# Altium schematic sheet MCU_3.6.SchDoc: MCU_3.6
size A3; DrawnBy: Máni Magnússon; Revision: A
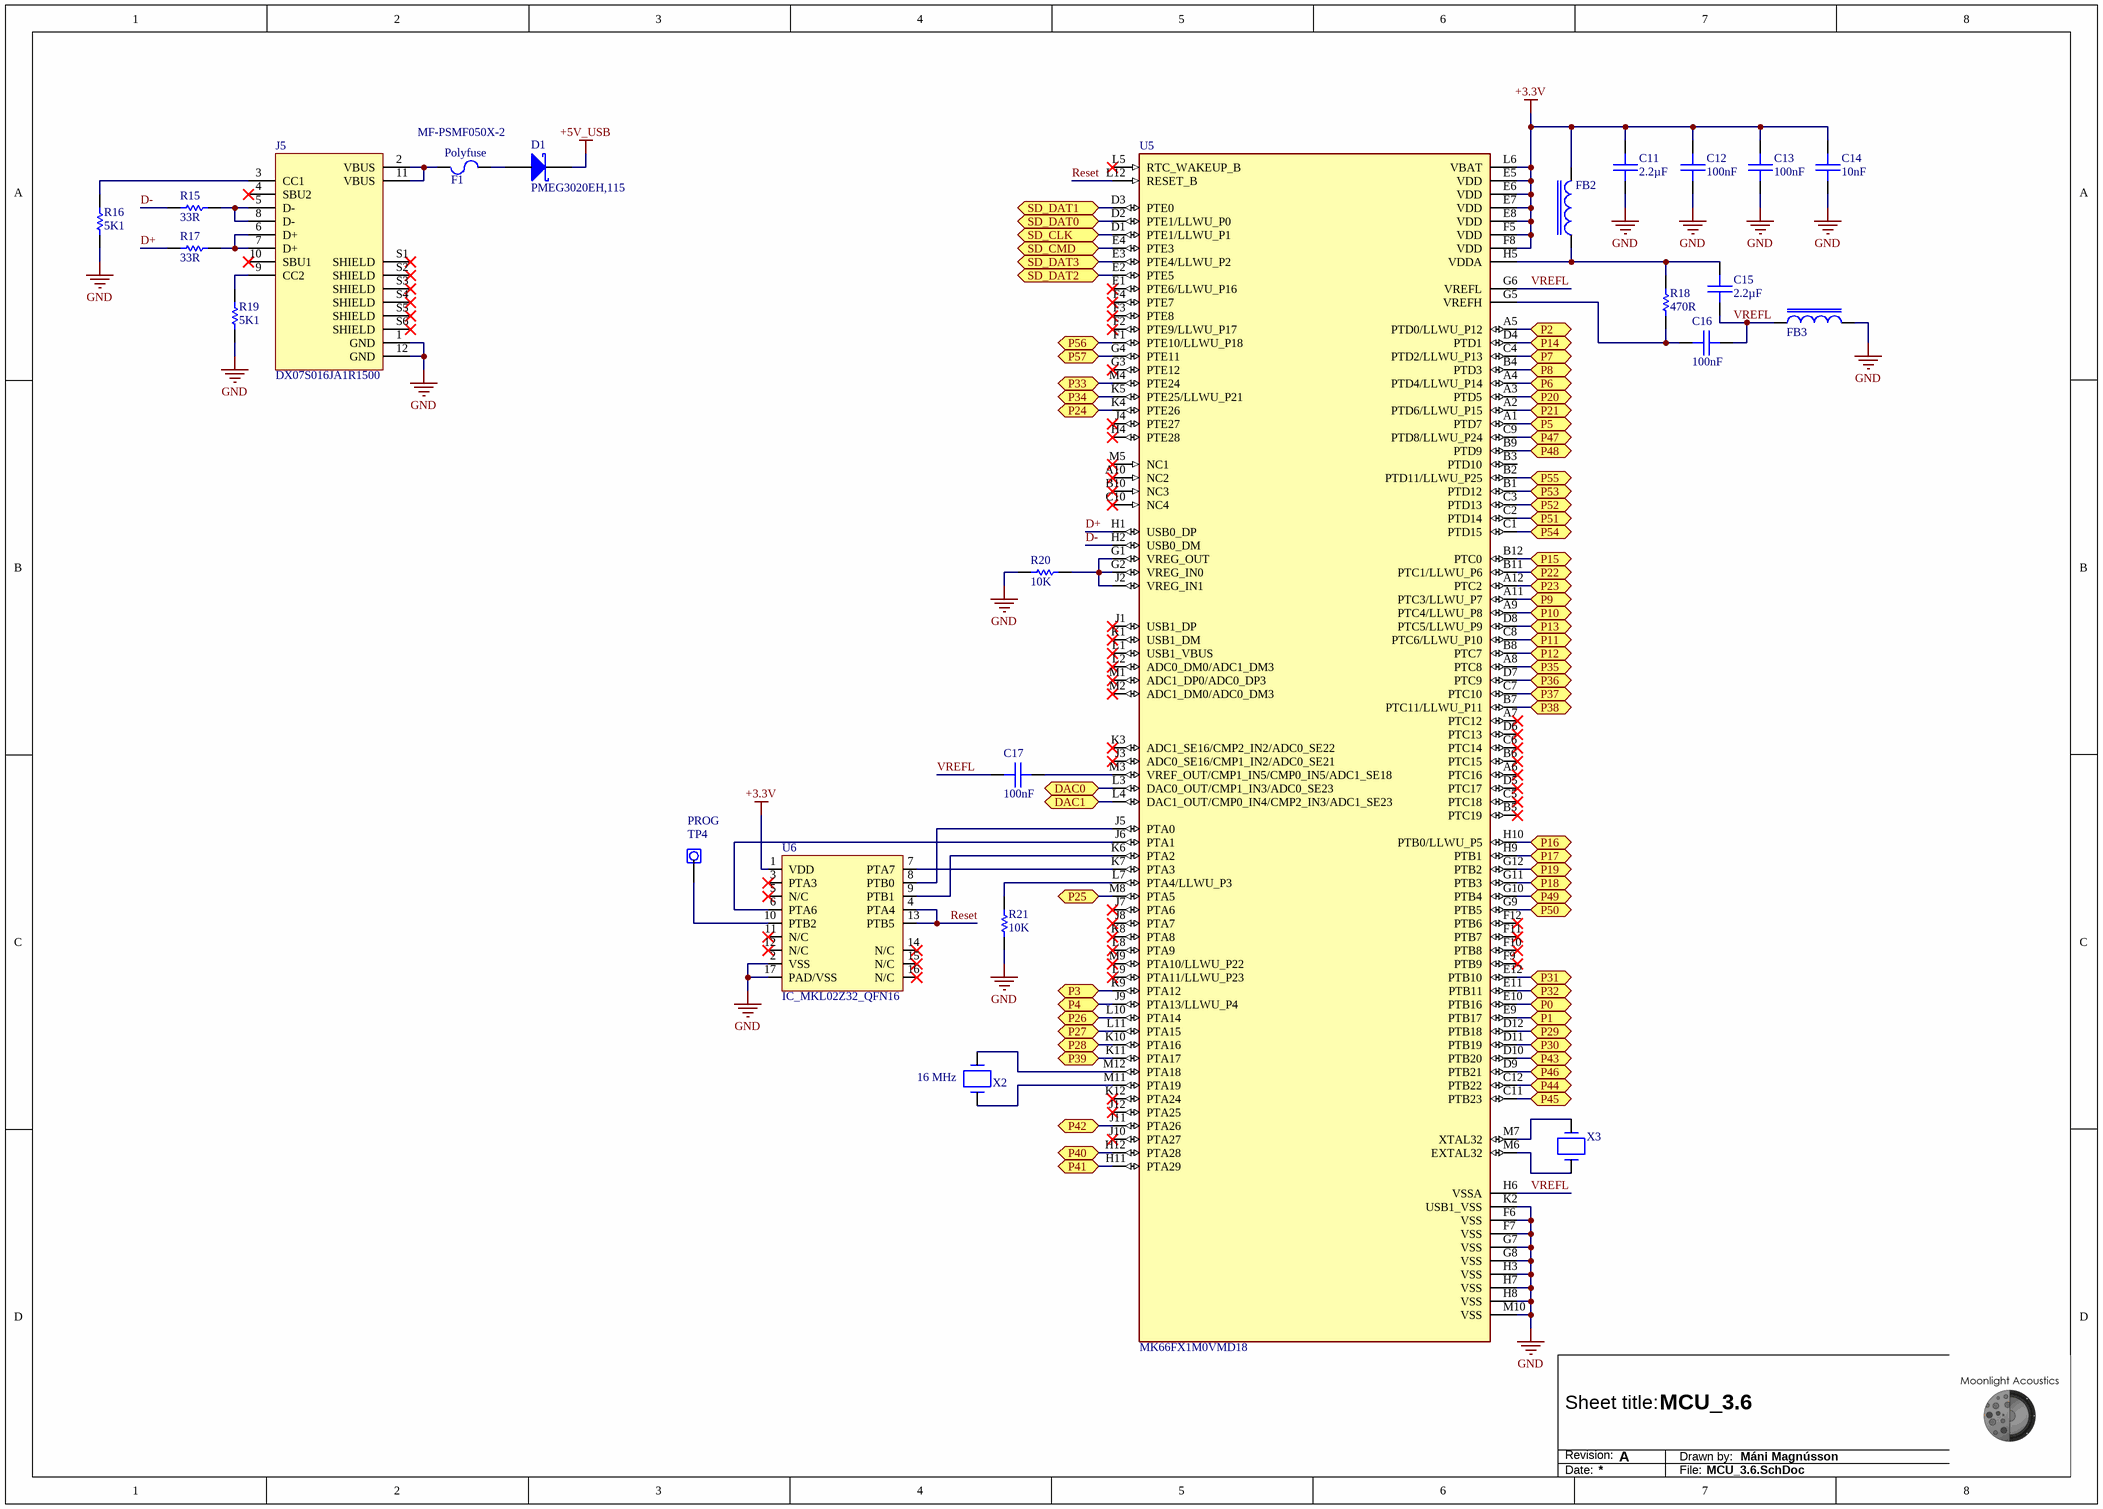
[diagram p0: MCU_3.6.SchDoc]

## Parts
C11  2.2µF  [0603_CAP]
C12  100nF  [0603_CAP]
C13  100nF  [0603_CAP]
C14  10nF  [0603_CAP]
C15  2.2µF  [0603_CAP]
C16  100nF  [0603_CAP]
C17  100nF  [0603_CAP]
D1  PMEG3020EH,115  [SOD-123]
F1  Polyfuse  [0805]
FB2  FBTH1608HL221-T  [0603_FERRITE]  (value not drawn)
FB3  FBTH1608HL221-T  [0603_FERRITE]  (value not drawn)
J5  DX07S016JA1R1500  [JAE_DX07S016JA1R1500]
R15  33R  [0603_RES]
R16  5K1  [0603_RES]
R17  33R  [0603_RES]
R18  470R  [0603_RES]
R19  5K1  [0603_RES]
R20  10K  [0603_RES]
R21  10K  [0603_RES]
TP4  PROG  [Testpoint2]
U5  MK66FX1M0VMD18  [BGA144C100P12X12_1300X1300X170]
U6  IC_MKL02Z32_QFN16  [QFN50P300X300X65-17N]
X2  NX3225SA-16.000000MHZ-B3  [XTAL_NX3225SA]  (value not drawn)
X3  ABS07-166-32.768KHZ-T  [XTAL_ABS07-166]  (value not drawn)

## Ports
DAC0 (bidir), DAC1 (bidir), P0 (bidir), P1 (bidir), P2 (bidir), P3 (bidir), P4 (bidir), P5 (bidir), P6 (bidir), P7 (bidir), P8 (bidir), P9 (bidir), P10 (bidir), P11 (bidir), P12 (bidir), P13 (bidir), P14 (bidir), P15 (bidir), P16 (bidir), P17 (bidir), P18 (bidir), P19 (bidir), P20 (bidir), P21 (bidir), P22 (bidir), P23 (bidir), P24 (bidir), P25 (bidir), P26 (bidir), P27 (bidir), P28 (bidir), P29 (bidir), P30 (bidir), P31 (bidir), P32 (bidir), P33 (bidir), P34 (bidir), P35 (bidir), P36 (bidir), P37 (bidir), P38 (bidir), P39 (bidir), P40 (bidir), P41 (bidir), P42 (bidir), P43 (bidir), P44 (bidir), P45 (bidir), P46 (bidir), P47 (bidir), P48 (bidir), P49 (bidir), P50 (bidir), P51 (bidir), P52 (bidir), P53 (bidir), P54 (bidir), P55 (bidir), P56 (bidir), P57 (bidir), SD_CLK (bidir), SD_CMD (bidir), SD_DAT0 (bidir), SD_DAT1 (bidir), SD_DAT2 (bidir), SD_DAT3 (bidir)

## Nets
+3.3V: C11.1 C12.1 C13.1 C14.1 FB2.2 U5.E5(VDD) U5.E6(VDD) U5.E7(VDD) U5.E8(VDD) U5.F5(VDD) U5.F8(VDD) U5.L6(VBAT) U6.1(VDD)
+5V_USB: D1.2(K)
GND: C11.2 C12.2 C13.2 C14.2 FB3.1 J5.1(GND) J5.12(GND) R16.2 R19.2 R20.1 R21.1 U5.F6(VSS) U5.F7(VSS) U5.G7(VSS) U5.G8(VSS) U5.H3(VSS) U5.H7(VSS) U5.H8(VSS) U5.K2(USB1_VSS) U5.M10(VSS) U6.2(VSS) U6.17(PAD/VSS)
D+: R17.1 U5.H1(USB0_DP)
D-: R15.1 U5.H2(USB0_DM)
DAC0: U5.L3(DAC0_OUT/CMP1_IN3/ADC0_SE23) ; port DAC0
DAC1: U5.L4(DAC1_OUT/CMP0_IN4/CMP2_IN3/ADC1_SE23) ; port DAC1
P0: U5.E10(PTB16) ; port P0
P1: U5.E9(PTB17) ; port P1
P2: U5.A5(PTD0/LLWU_P12) ; port P2
P3: U5.K9(PTA12) ; port P3
P4: U5.J9(PTA13/LLWU_P4) ; port P4
P5: U5.A1(PTD7) ; port P5
P6: U5.A4(PTD4/LLWU_P14) ; port P6
P7: U5.C4(PTD2/LLWU_P13) ; port P7
P8: U5.B4(PTD3) ; port P8
P9: U5.A11(PTC3/LLWU_P7) ; port P9
P10: U5.A9(PTC4/LLWU_P8) ; port P10
P11: U5.C8(PTC6/LLWU_P10) ; port P11
P12: U5.B8(PTC7) ; port P12
P13: U5.D8(PTC5/LLWU_P9) ; port P13
P14: U5.D4(PTD1) ; port P14
P15: U5.B12(PTC0) ; port P15
P16: U5.H10(PTB0/LLWU_P5) ; port P16
P17: U5.H9(PTB1) ; port P17
P18: U5.G11(PTB3) ; port P18
P19: U5.G12(PTB2) ; port P19
P20: U5.A3(PTD5) ; port P20
P21: U5.A2(PTD6/LLWU_P15) ; port P21
P22: U5.B11(PTC1/LLWU_P6) ; port P22
P23: U5.A12(PTC2) ; port P23
P24: U5.K4(PTE26) ; port P24
P25: U5.M8(PTA5) ; port P25
P26: U5.L10(PTA14) ; port P26
P27: U5.L11(PTA15) ; port P27
P28: U5.K10(PTA16) ; port P28
P29: U5.D12(PTB18) ; port P29
P30: U5.D11(PTB19) ; port P30
P31: U5.E12(PTB10) ; port P31
P32: U5.E11(PTB11) ; port P32
P33: U5.M4(PTE24) ; port P33
P34: U5.K5(PTE25/LLWU_P21) ; port P34
P35: U5.A8(PTC8) ; port P35
P36: U5.D7(PTC9) ; port P36
P37: U5.C7(PTC10) ; port P37
P38: U5.B7(PTC11/LLWU_P11) ; port P38
P39: U5.K11(PTA17) ; port P39
P40: U5.H12(PTA28) ; port P40
P41: U5.H11(PTA29) ; port P41
P42: U5.J11(PTA26) ; port P42
P43: U5.D10(PTB20) ; port P43
P44: U5.C12(PTB22) ; port P44
P45: U5.C11(PTB23) ; port P45
P46: U5.D9(PTB21) ; port P46
P47: U5.C9(PTD8/LLWU_P24) ; port P47
P48: U5.B9(PTD9) ; port P48
P49: U5.G10(PTB4) ; port P49
P50: U5.G9(PTB5) ; port P50
P51: U5.C2(PTD14) ; port P51
P52: U5.C3(PTD13) ; port P52
P53: U5.B1(PTD12) ; port P53
P54: U5.C1(PTD15) ; port P54
P55: U5.B2(PTD11/LLWU_P25) ; port P55
P56: U5.F1(PTE10/LLWU_P18) ; port P56
P57: U5.G4(PTE11) ; port P57
Reset: U5.L12(RESET_B) U6.4(PTA4) U6.13(PTB5)
SD_CLK: U5.D1(PTE1/LLWU_P1) ; port SD_CLK
SD_CMD: U5.E4(PTE3) ; port SD_CMD
SD_DAT0: U5.D2(PTE1/LLWU_P0) ; port SD_DAT0
SD_DAT1: U5.D3(PTE0) ; port SD_DAT1
SD_DAT2: U5.E2(PTE5) ; port SD_DAT2
SD_DAT3: U5.E3(PTE4/LLWU_P2) ; port SD_DAT3
VREFL: C15.2 C16.2 C17.1 FB3.2 U5.G6(VREFL) U5.H6(VSSA)
NetC15_1: C15.1 FB2.1 R18.1 U5.H5(VDDA)
NetC16_1: C16.1 R18.2 U5.G5(VREFH)
NetC17_2: C17.2 U5.M3(VREF_OUT/CMP1_IN5/CMP0_IN5/ADC1_SE18)
NetD1_1: D1.1(A) F1.2
NetF1_1: F1.1 J5.2(VBUS) J5.11(VBUS)
NetJ5_3: J5.3(CC1) R16.1
NetJ5_5: J5.5(D-) J5.8(D-) R15.2
NetJ5_6: J5.6(D+) J5.7(D+) R17.2
NetJ5_9: J5.9(CC2) R19.1
NetR20_2: R20.2 U5.G1(VREG_OUT) U5.G2(VREG_IN0) U5.J2(VREG_IN1)
NetR21_2: R21.2 U5.L7(PTA4/LLWU_P3)
NetTP4_1: TP4.1 U6.10(PTB2)
NetU5_J5: U5.J5(PTA0) U6.8(PTB0)
NetU5_J6: U5.J6(PTA1) U6.6(PTA6)
NetU5_K6: U5.K6(PTA2) U6.9(PTB1)
NetU5_K7: U5.K7(PTA3) U6.7(PTA7)
NetU5_M6: U5.M6(EXTAL32) X3.1
NetU5_M7: U5.M7(XTAL32) X3.2
NetU5_M11: U5.M11(PTA19) X2.1
NetU5_M12: U5.M12(PTA18) X2.3

Not connected (* = marked no-connect by the designer): J5 4(SBU2)* 10(SBU1)* S1(SHIELD)* S2(SHIELD)* S3(SHIELD)* S4(SHIELD)* S5(SHIELD)* S6(SHIELD)*; U5 A6(PTC16)* A7(PTC12)* A10(NC2)* B3(PTD10) B5(PTC19)* B6(PTC15)* B10(NC3)* C5(PTC18)* C6(PTC14)* C10(NC4)* D5(PTC17)* D6(PTC13)* E1(PTE6/LLWU_P16)* F2(PTE9/LLWU_P17)* F3(PTE8)* F4(PTE7)* F9(PTB9)* F10(PTB8)* F11(PTB7)* F12(PTB6)* G3(PTE12)* H4(PTE28)* J1(USB1_DP)* J3(ADC0_SE16/CMP1_IN2/ADC0_SE21)* J4(PTE27)* J7(PTA6)* J8(PTA7)* J10(PTA27)* J12(PTA25)* K1(USB1_DM)* K3(ADC1_SE16/CMP2_IN2/ADC0_SE22)* K8(PTA8)* K12(PTA24)* L1(USB1_VBUS)* L2(ADC0_DM0/ADC1_DM3)* L5(RTC_WAKEUP_B)* L8(PTA9)* L9(PTA11/LLWU_P23)* M1(ADC1_DP0/ADC0_DP3)* M2(ADC1_DM0/ADC0_DM3)* M5(NC1)* M9(PTA10/LLWU_P22)*; U6 3(PTA3)* 5(N/C)* 11(N/C)* 12(N/C)* 14(N/C)* 15(N/C)* 16(N/C)*

## Notes on the sheet
- MF-PSMF050X-2
- (near X2) 16 MHz
- Sheet title:
- Revision:
- Drawn by:
- Date:
- File:

## Library data of the parts
C11-C17 = Capacitor
D1 = Schottky diode
F1 = Fuse
FB2 FB3 = Ferrite Bead: Digikey part no. / 587-FBTH1608HL221-TCT-ND
J5 = DX07S016JA1R1500: USB 2.0 Type C Receptacle Dip Type, PCB Top Mount (Digikey part no. 670-DX07S016JA1R1500CT-ND); MF: JAE Electronics; Value: *; Price: None; Package: None; Availability: Unavailable; MP: DX07S016JA1R1500; DigiKey-Purchase-URL: https://snapeda.com/shop?store=DigiKey&id=4551013; SnapEDA_Link: https://www.snapeda.com/parts/DX07S016JA1R1500/JAE%20Electronics/view-part/4551013/?ref=snap
R15-R21 = Resistor
TP4 = Testpoint
U5 = MK66FX1M0VMD18: 32-bit ARM Cortex-M4F Microcontroller 180 MHz 144-MAPBGA / DigiKey part no. 568-13335-ND; MF: NXP USA; SnapEDA_Link: https://www.snapeda.com/parts/MK66FX1M0VMD18/NXP%20USA%20Inc./view-part/567598/?ref=snap; Availability: Unavailable; MP: MK66FX1M0VMD18; Price: None; Value: *; Package: MAPBGA-144 NXP Semiconductors
U6 = IC_MKL02Z32_QFN16: Teensy bootloader; MP: MKL02Z32VFG4; MF: NXP USA; Availability: Unavailable; Price: None; Value: *; SnapEDA_Link: https://www.snapeda.com/parts/MKL02Z32VFG4/NXP%20USA%20Inc./view-part/492537/?ref=snap; Package: QFN-16 NXP Semiconductors
X2 = XTAL_16 MHz: Digikey part no. 644-1099-1-ND
X3 = XTAL_32.768 kHz: Digikey part no. 535-14514-1-ND / Requires 12pF load capacitors